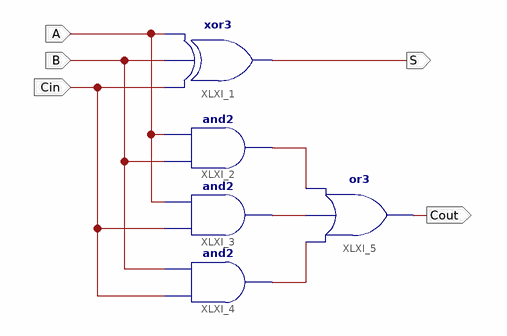
[diagram p0: schematic sheet 1]
// Xilinx ISE schematic SomadorCompleto.sch (spartan3e) as structural Verilog: 5 symbols, 5 ports
module SomadorCompleto (
  input  A,
  input  B,
  input  Cin,
  output S,
  output Cout
);

  wire XLXN_1, XLXN_2, XLXN_3;

  xor XLXI_1 (S, Cin, B, A);
  and XLXI_2 (XLXN_1, B, A);
  and XLXI_3 (XLXN_2, Cin, A);
  and XLXI_4 (XLXN_3, Cin, B);
  or XLXI_5 (Cout, XLXN_3, XLXN_2, XLXN_1);
endmodule
